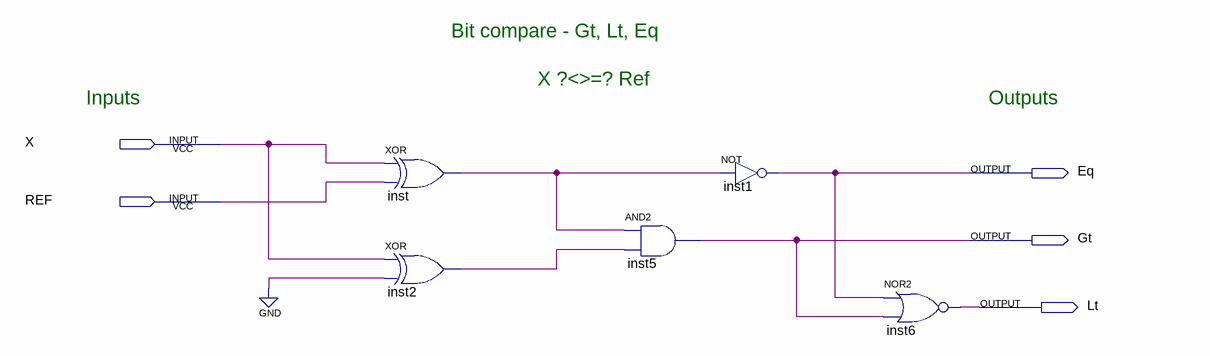
[diagram p0: schematic sheet]
// Quartus schematic bit_compare.bdf as structural Verilog: 5 symbols, 5 pins
module bit_compare (
  input  X,
  input  REF,
  output Eq,
  output Gt,
  output Lt
);

  wire inst2_out, inst_out;

  xor inst (inst_out, X, REF);
  xor inst2 (inst2_out, X, 1'b0);
  and inst5 (Gt, inst_out, inst2_out);
  not inst1 (Eq, inst_out);
  nor inst6 (Lt, Eq, Gt);

  // Notes on the sheet:
  //   Bit compare - Gt, Lt, Eq    
  //   X ?<>=? Ref  
  //   Inputs  
  //   Outputs  
endmodule
